# Altium schematic sheet 0165_VCCINAUX_CPU VR CO.SchDoc
size 848 x 558 mm
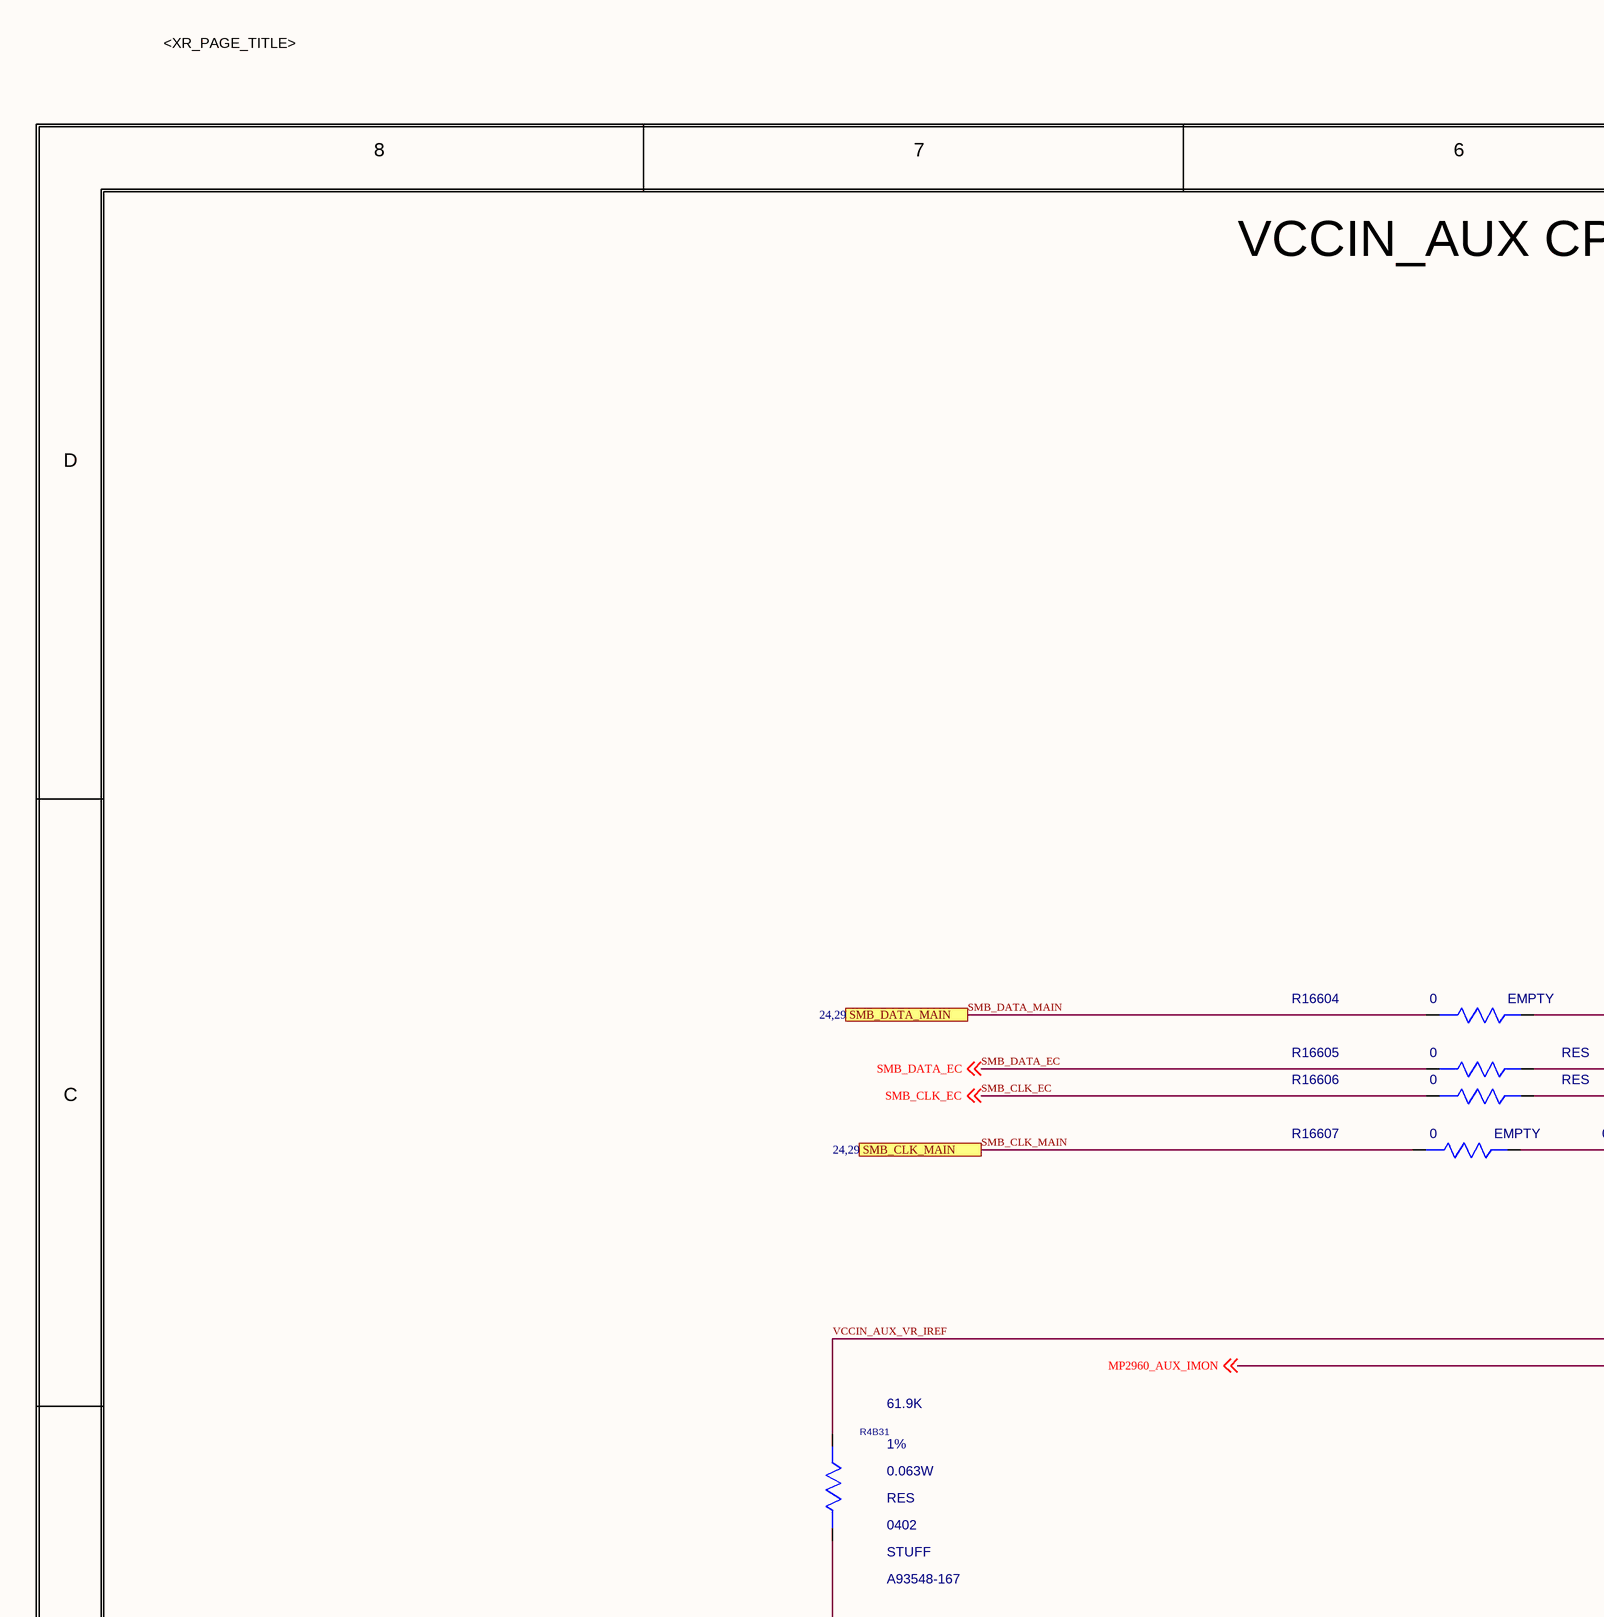
[diagram p0: 0165_VCCINAUX_CPU VR CO.SchDoc, top left]
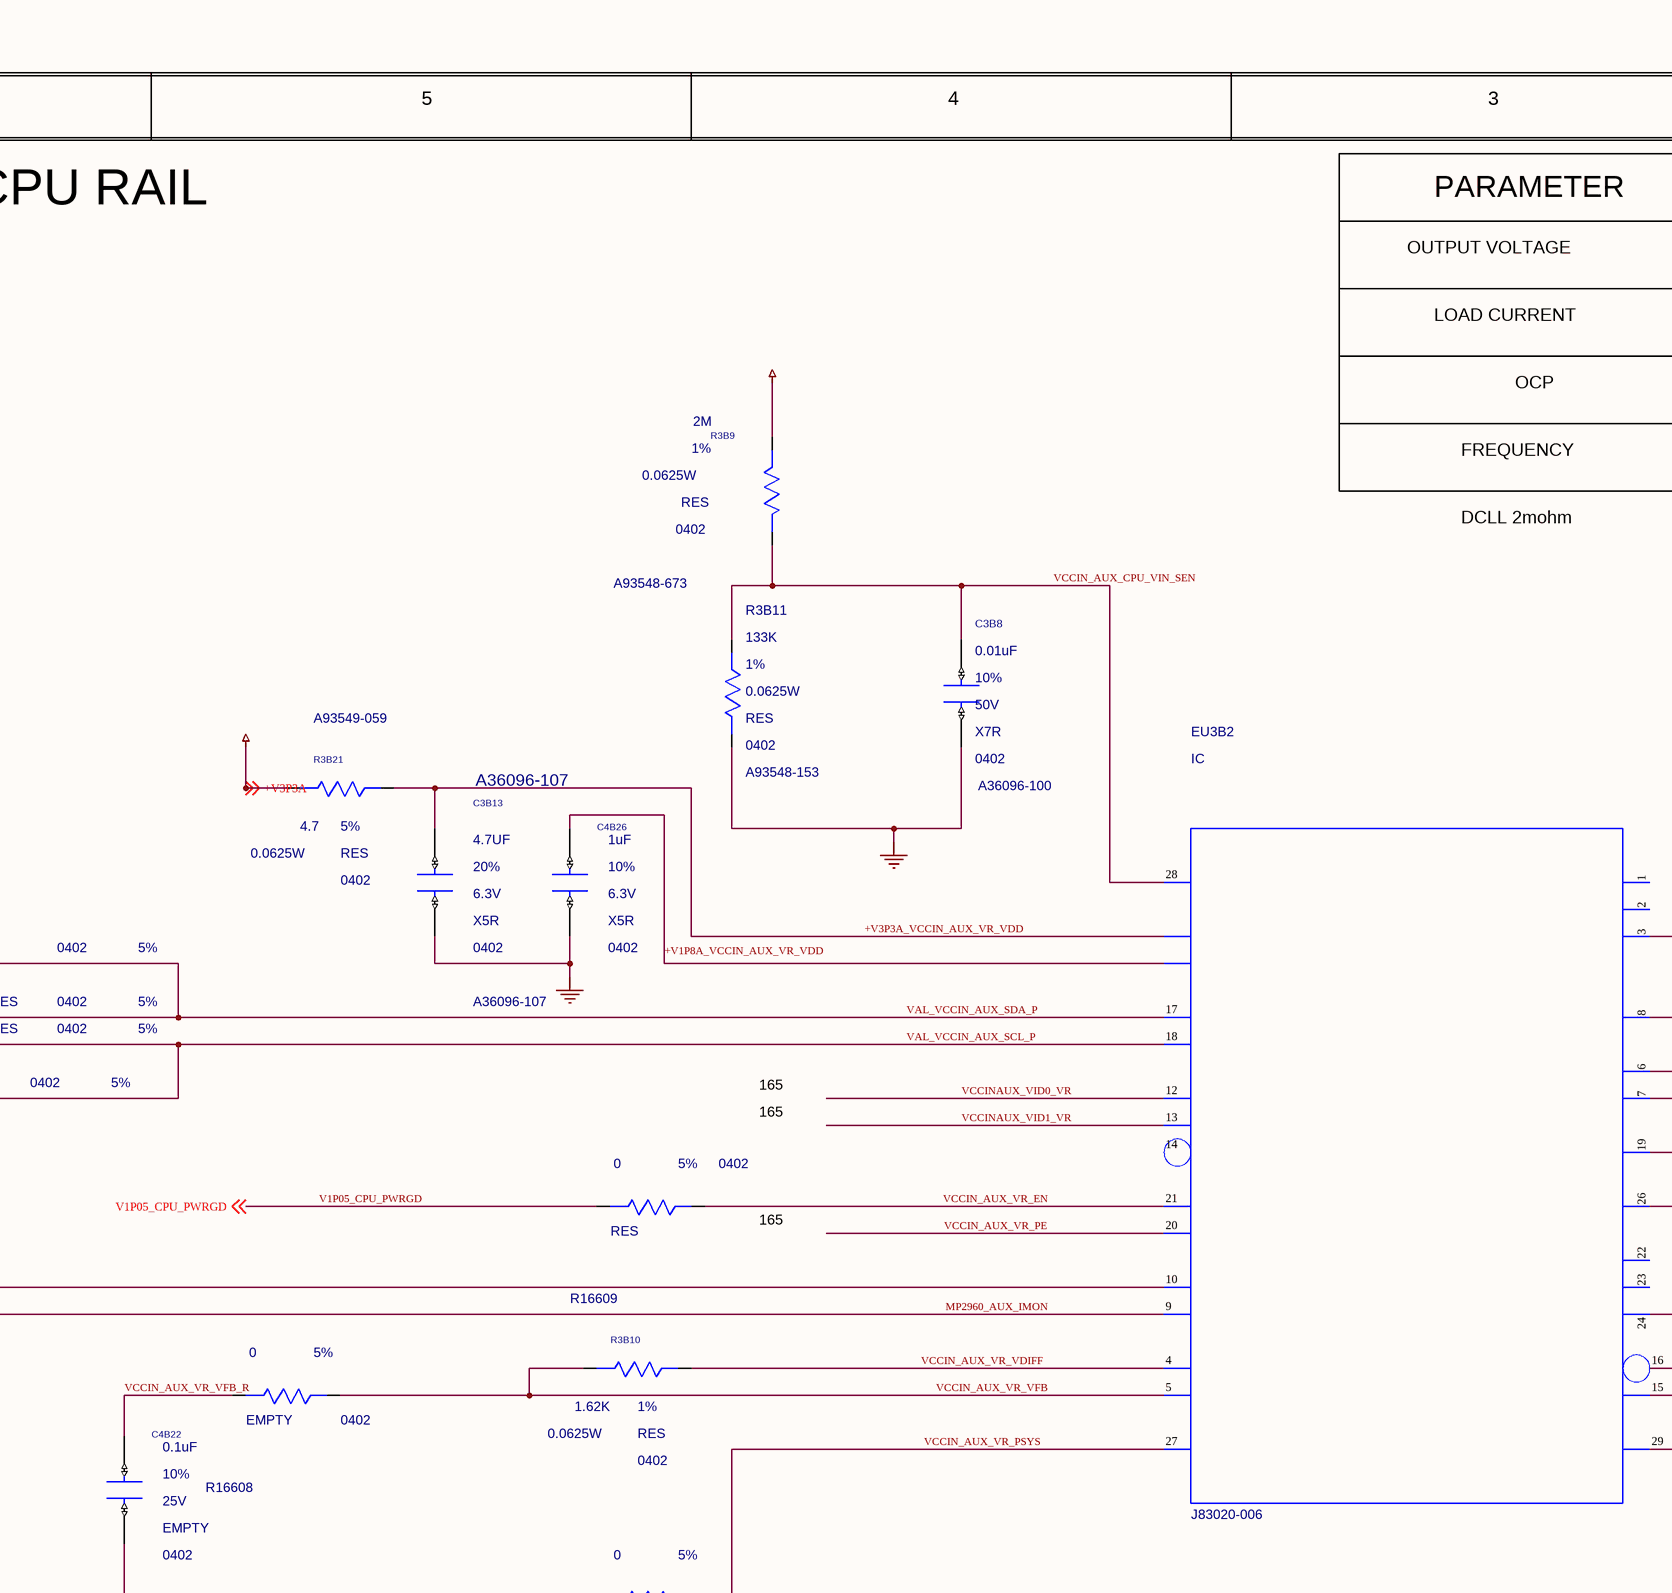
[diagram p1: 0165_VCCINAUX_CPU VR CO.SchDoc, top middle]
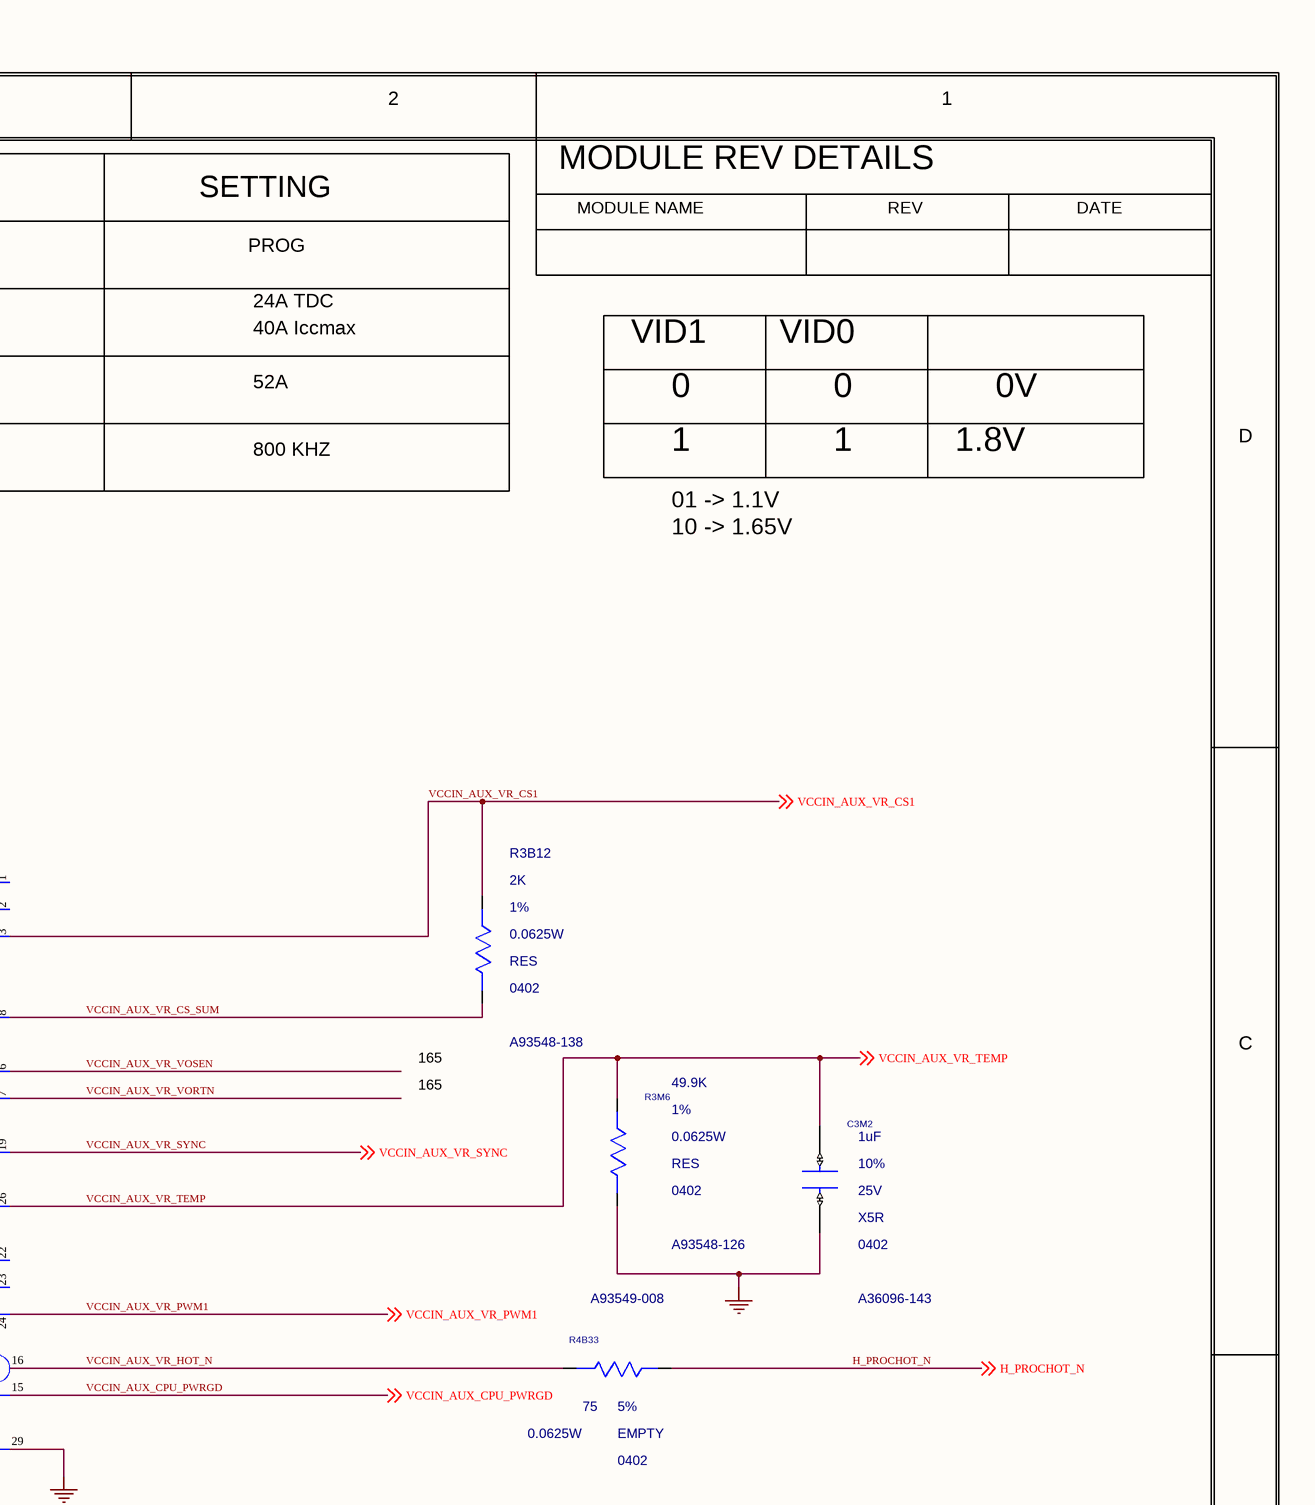
[diagram p2: 0165_VCCINAUX_CPU VR CO.SchDoc, top right]
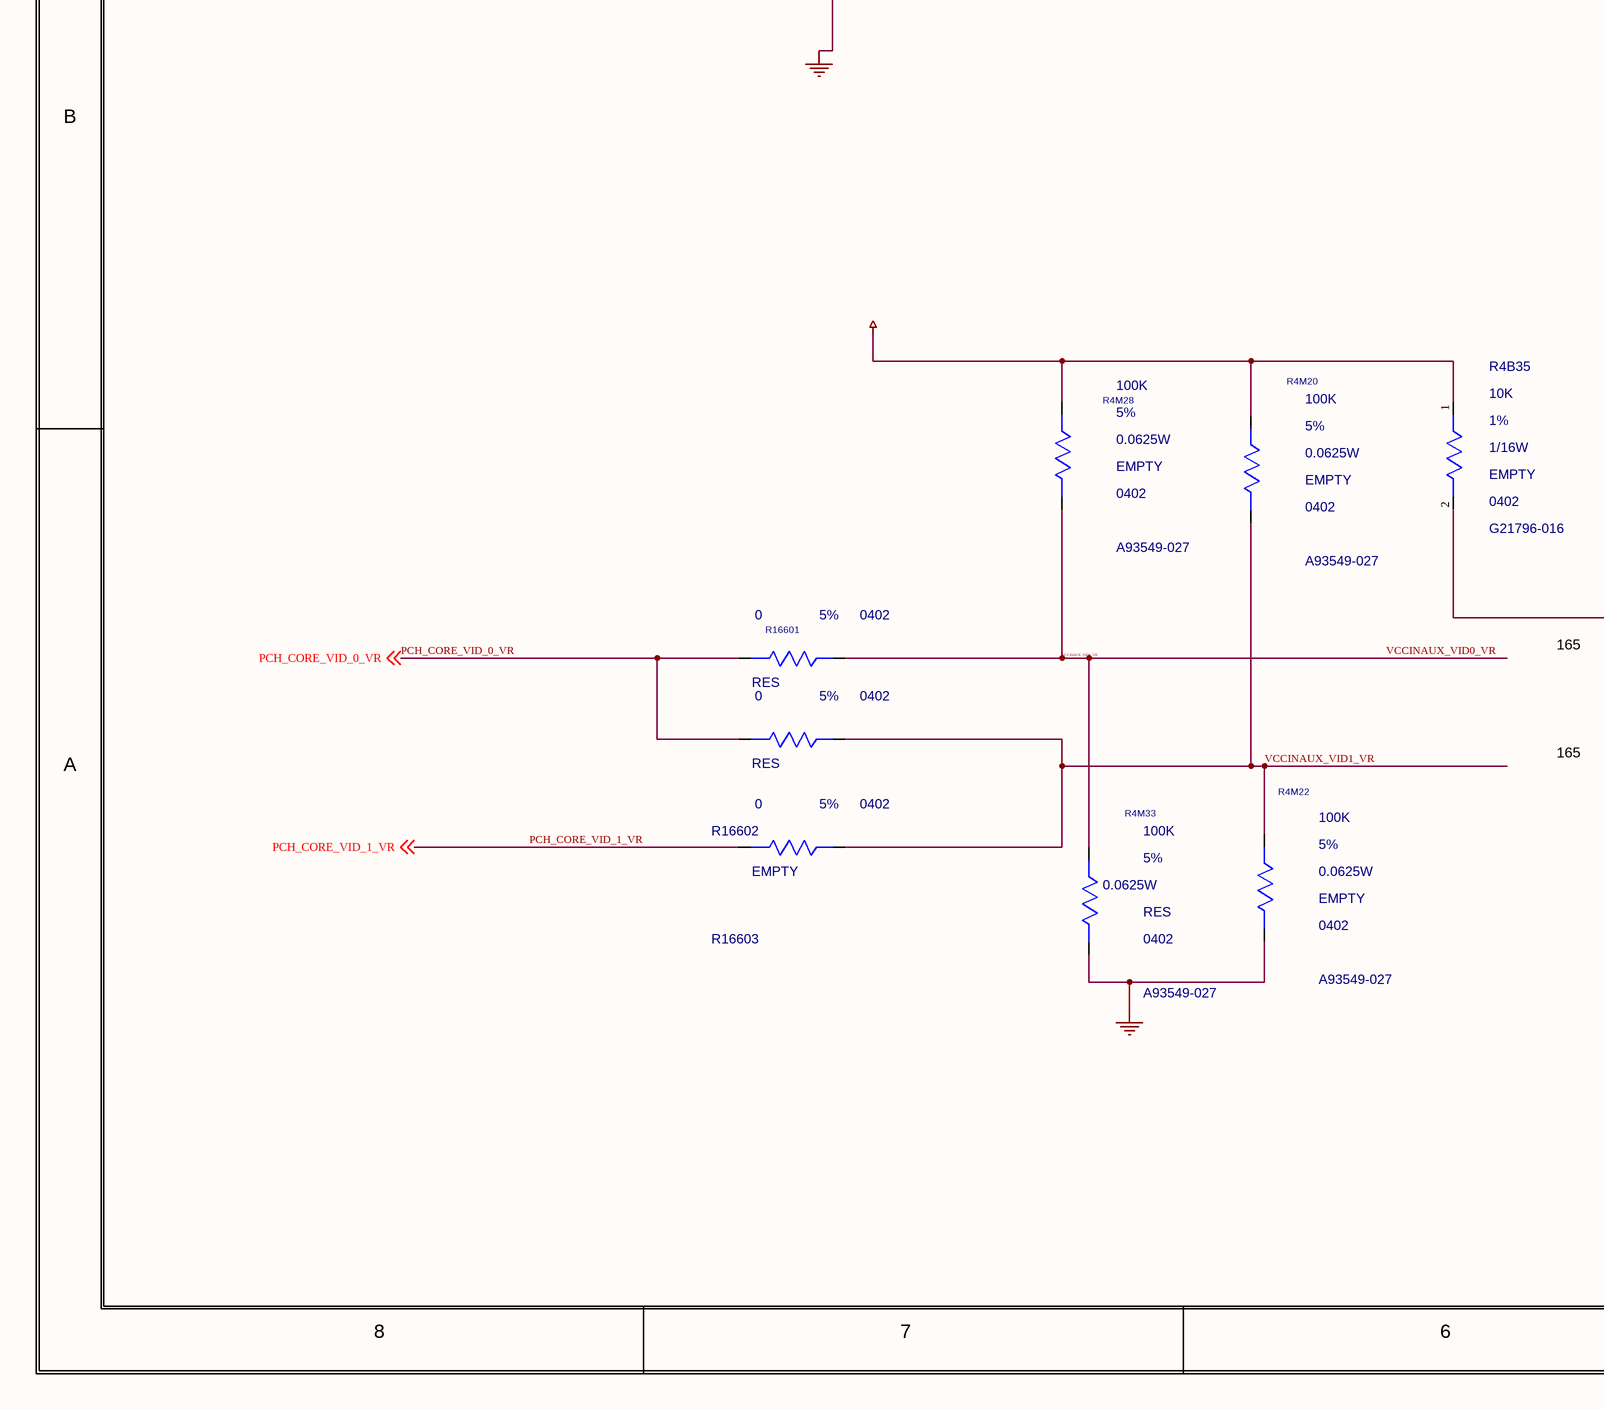
[diagram p3: 0165_VCCINAUX_CPU VR CO.SchDoc, bottom left]
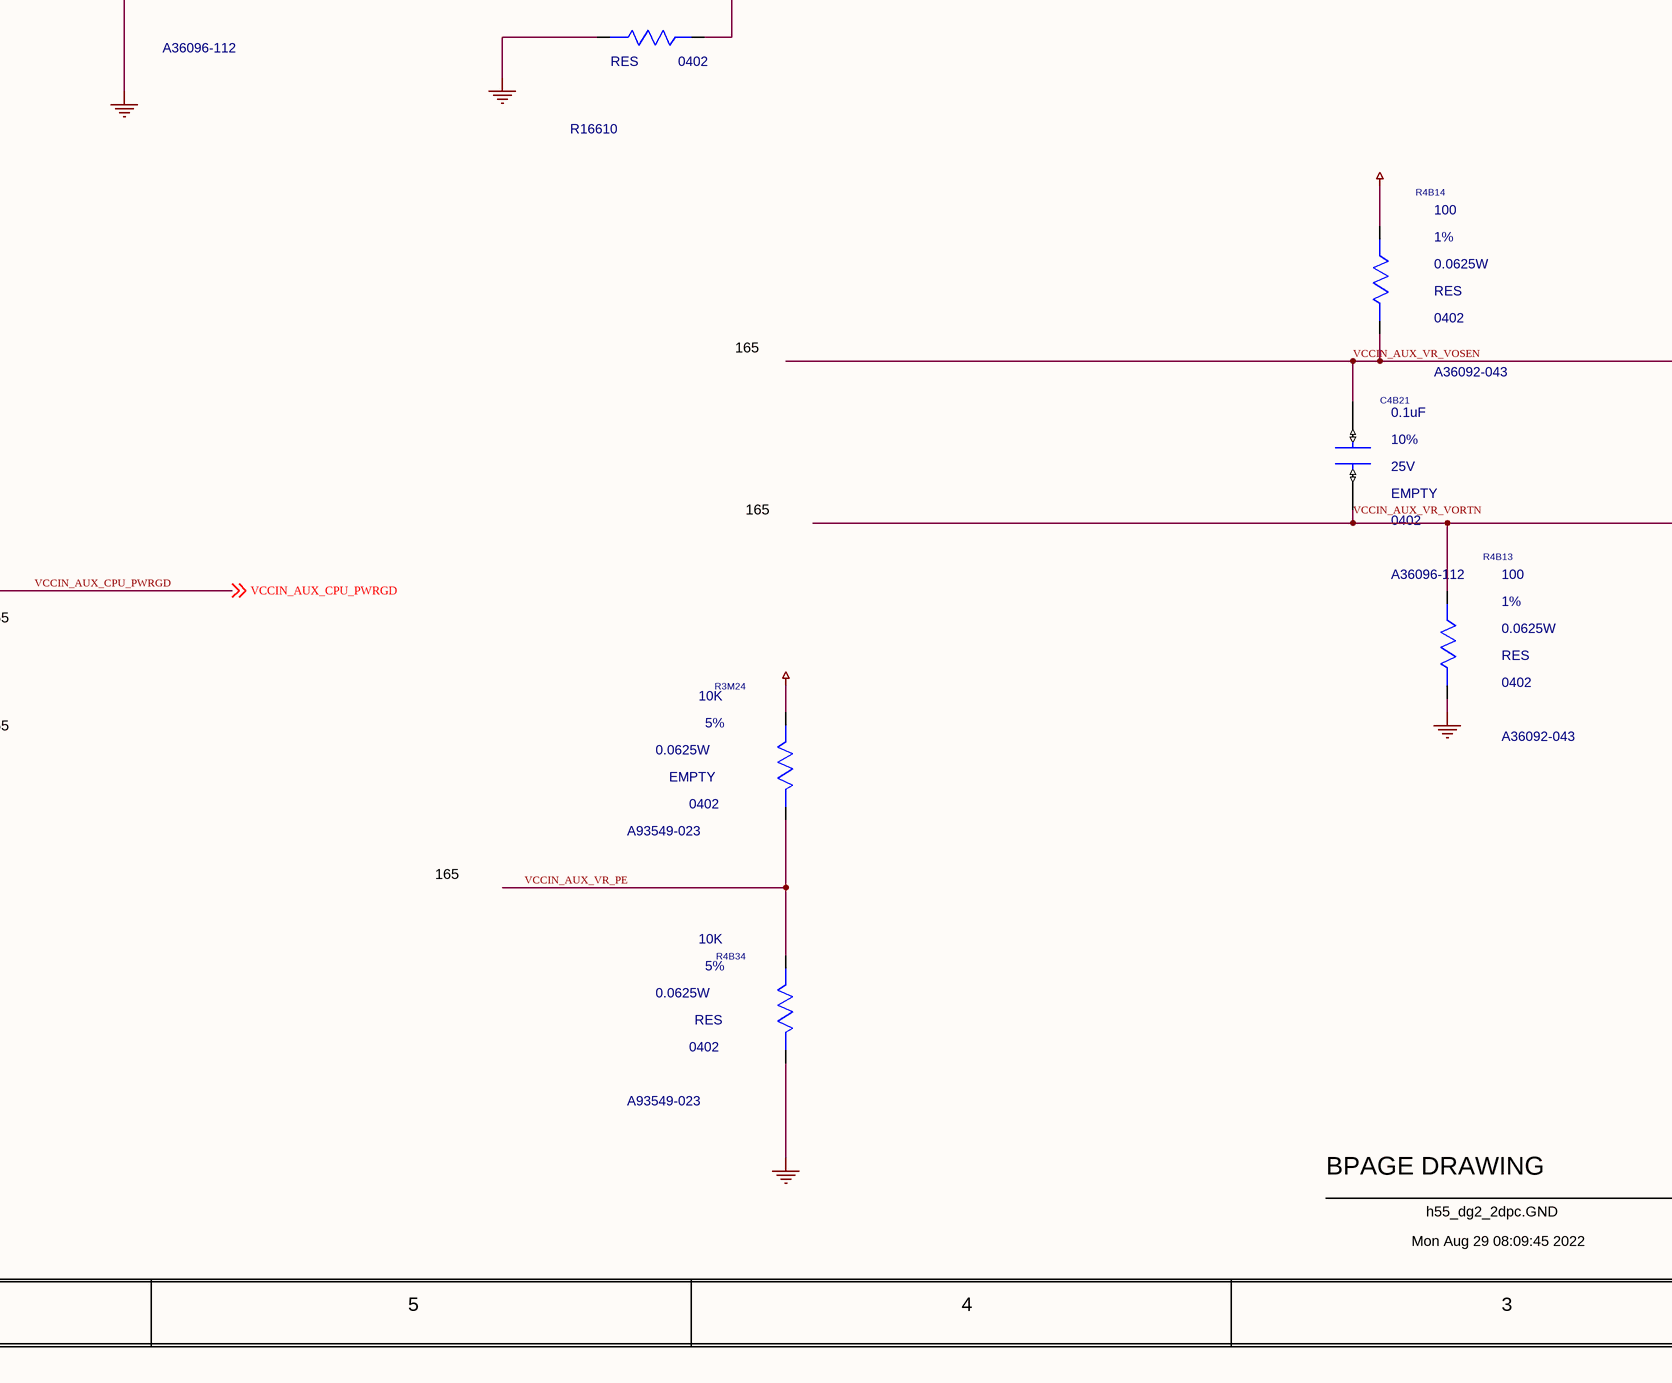
[diagram p4: 0165_VCCINAUX_CPU VR CO.SchDoc, bottom middle]
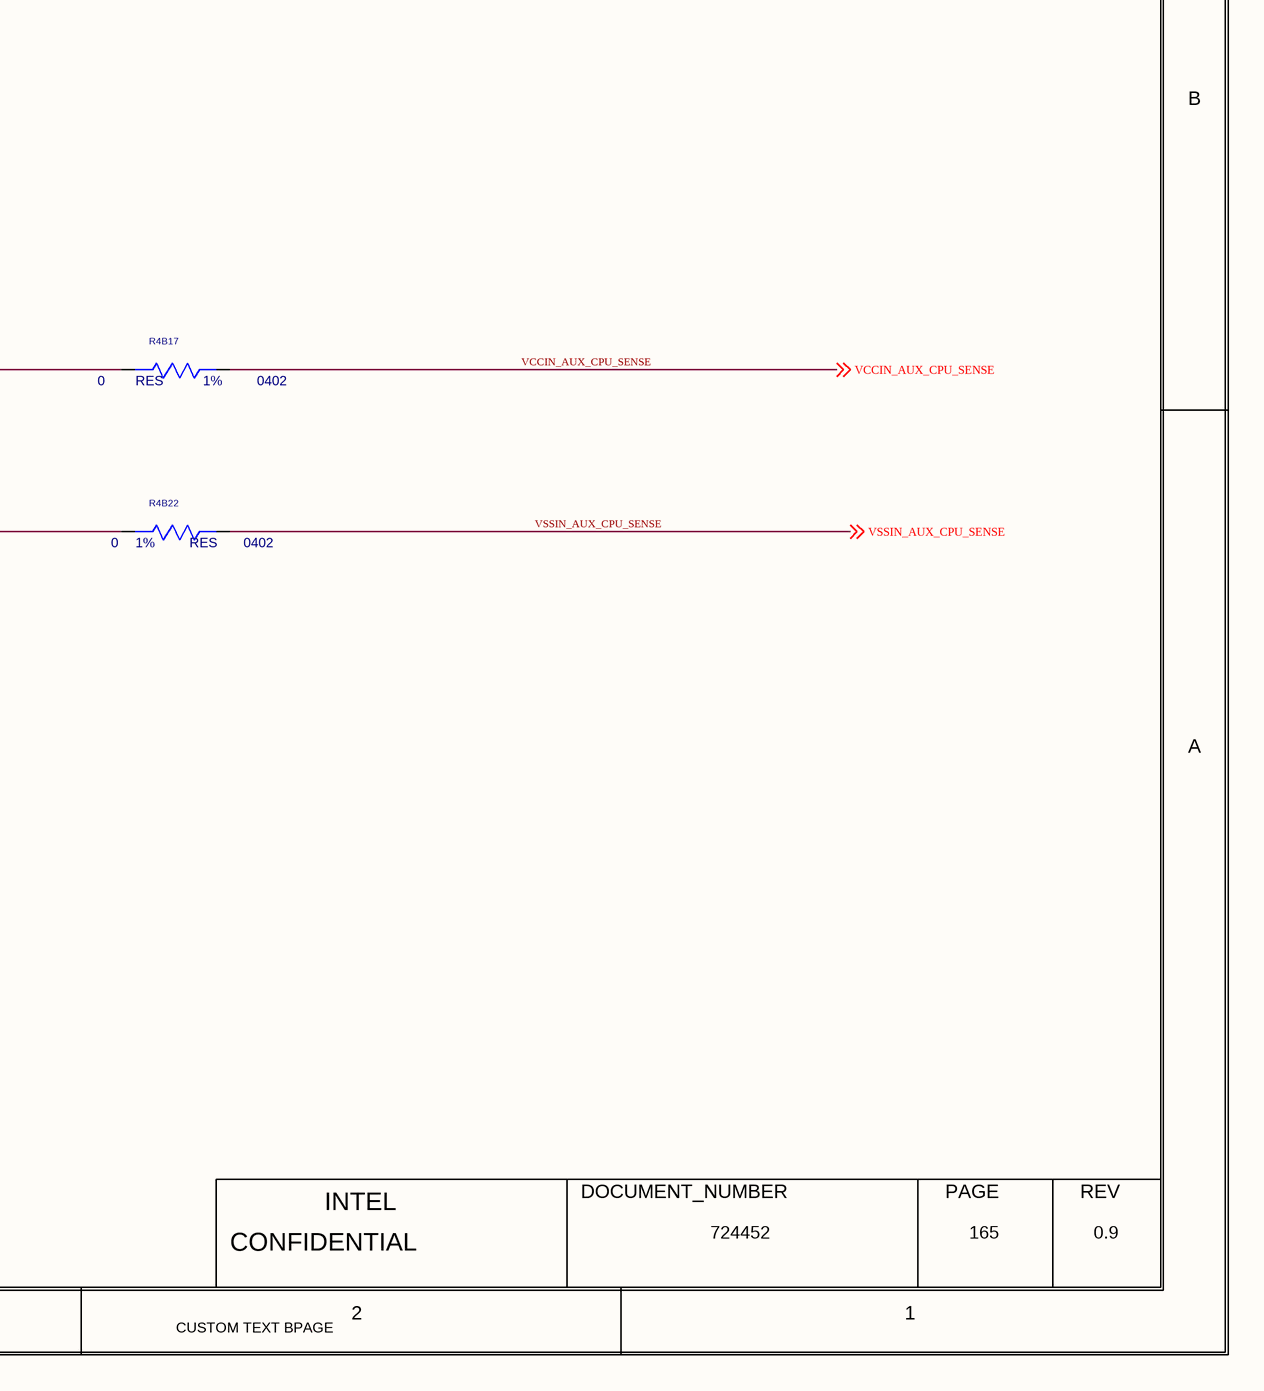
[diagram p5: 0165_VCCINAUX_CPU VR CO.SchDoc, bottom right]

## Parts
C3B8  0.01uF  MATERIAL: X7R  PACK_TYPE: 0402  PART_NUMBER: A36096-100  TOLERANCE: 10%  VOLTAGE: 50V  [CTK2_SM0402_1050X550_MA]
C3B13  4.7UF  MATERIAL: X5R  PACK_TYPE: 0402  PART_NUMBER: A36096-107  TOLERANCE: 20%  VOLTAGE: 6.3V  [CTK2_SM0402_1200X700_MA]
C3M2  1uF  MATERIAL: X5R  PACK_TYPE: 0402  PART_NUMBER: A36096-143  TOLERANCE: 10%  VOLTAGE: 25V  [CTK0_SM0402_1050X550_MA]
C4B21  0.1uF  MATERIAL: EMPTY  PACK_TYPE: 0402  PART_NUMBER: A36096-112  TOLERANCE: 10%  VOLTAGE: 25V  [CTK0_SM0402_1050X550_MA]
C4B22  0.1uF  MATERIAL: EMPTY  PACK_TYPE: 0402  PART_NUMBER: A36096-112  TOLERANCE: 10%  VOLTAGE: 25V  [CTK0_SM0402_1050X550_MA]
C4B26  1uF  MATERIAL: X5R  PACK_TYPE: 0402  TOLERANCE: 10%  VOLTAGE: 6.3V  [CTK2_SM0402_1050X550_MA]
EU3B2  MATERIAL: IC  PART_NUMBER: J83020-006  [CTK2_LCC28_S4100_400_DFS2600_MB]  (hidden comment: C_MP2940C)
R3B9  2M  MATERIAL: RES  PACK_TYPE: 0402  PART_NUMBER: A93548-673  TOLERANCE: 1%  WATTAGE: 0.0625W  [CTK0_SM0402_1050X550_MA]
R3B10  1.62K  MATERIAL: RES  PACK_TYPE: 0402  TOLERANCE: 1%  WATTAGE: 0.0625W  [CTK2_SM0402_1100X550_MA]
R3B11  133K  MATERIAL: RES  PACK_TYPE: 0402  PART_NUMBER: A93548-153  TOLERANCE: 1%  WATTAGE: 0.0625W  [CTK2_SM0402_1100X550_MA]
R3B12  2K  MATERIAL: RES  PACK_TYPE: 0402  PART_NUMBER: A93548-138  TOLERANCE: 1%  WATTAGE: 0.0625W  [CTK2_SM0402_1100X550_MA]
R3B21  4.7  MATERIAL: RES  PACK_TYPE: 0402  PART_NUMBER: A93549-059  TOLERANCE: 5%  WATTAGE: 0.0625W  [CTK0_SM0402_1100X550_MA]
R3M6  49.9K  MATERIAL: RES  PACK_TYPE: 0402  PART_NUMBER: A93548-126  TOLERANCE: 1%  WATTAGE: 0.0625W  [CTK0_SM0402_1100X550_MA]
R3M24  10K  MATERIAL: EMPTY  PACK_TYPE: 0402  PART_NUMBER: A93549-023  TOLERANCE: 5%  WATTAGE: 0.0625W  [CTK0_SM0402_1100X550_MA]
R4B13  100  MATERIAL: RES  PACK_TYPE: 0402  PART_NUMBER: A36092-043  TOLERANCE: 1%  WATTAGE: 0.0625W  [CTK0_SM0402_1050X550_MA]
R4B14  100  MATERIAL: RES  PACK_TYPE: 0402  PART_NUMBER: A36092-043  TOLERANCE: 1%  WATTAGE: 0.0625W  [CTK0_SM0402_1050X550_MA]
R4B17  0  MATERIAL: RES  PACK_TYPE: 0402  TOLERANCE: 1%  [CTK2_SM0402_1050X550_MA]
R4B22  0  MATERIAL: RES  PACK_TYPE: 0402  TOLERANCE: 1%  [CTK2_SM0402_1050X550_MA]
R4B31  61.9K  BOM_USE: STUFF  MATERIAL: RES  PACK_TYPE: 0402  PART_NUMBER: A93548-167  TOLERANCE: 1%  WATTAGE: 0.063W  [TK0_SM0402_1100X550_MI]
R4B33  75  MATERIAL: EMPTY  PACK_TYPE: 0402  PART_NUMBER: A93549-008  TOLERANCE: 5%  WATTAGE: 0.0625W  [CTK2_SM0402_1050X550_MA]
R4B34  10K  MATERIAL: RES  PACK_TYPE: 0402  PART_NUMBER: A93549-023  TOLERANCE: 5%  WATTAGE: 0.0625W  [CTK0_SM0402_1100X550_MA]
R4B35  10K  MATERIAL: EMPTY  PACK_TYPE: 0402  PART_NUMBER: G21796-016  TOLERANCE: 1%  WATTAGE: 1/16W  [SMR0402IA]
R4M20  100K  MATERIAL: EMPTY  PACK_TYPE: 0402  PART_NUMBER: A93549-027  TOLERANCE: 5%  WATTAGE: 0.0625W  [CTK0_SM0402_1100X550_MA]
R4M22  100K  MATERIAL: EMPTY  PACK_TYPE: 0402  PART_NUMBER: A93549-027  TOLERANCE: 5%  WATTAGE: 0.0625W  [CTK0_SM0402_1100X550_MA]
R4M28  100K  MATERIAL: EMPTY  PACK_TYPE: 0402  PART_NUMBER: A93549-027  TOLERANCE: 5%  WATTAGE: 0.0625W  [CTK0_SM0402_1100X550_MA]
R4M33  100K  MATERIAL: RES  PACK_TYPE: 0402  PART_NUMBER: A93549-027  TOLERANCE: 5%  WATTAGE: 0.0625W  [CTK0_SM0402_1100X550_MA]
R16601  0  MATERIAL: RES  PACK_TYPE: 0402  TOLERANCE: 5%  [CTK0_SM0402_1100X550_MA]
R16602  0  MATERIAL: RES  PACK_TYPE: 0402  TOLERANCE: 5%  [CTK0_SM0402_1100X550_MA]
R16603  0  MATERIAL: EMPTY  PACK_TYPE: 0402  TOLERANCE: 5%  [CTK0_SM0402_1100X550_MA]
R16604  0  MATERIAL: EMPTY  PACK_TYPE: 0402  TOLERANCE: 5%  [CTK0_SM0402_1100X550_MA]
R16605  0  MATERIAL: RES  PACK_TYPE: 0402  TOLERANCE: 5%  [CTK0_SM0402_1100X550_MA]
R16606  0  MATERIAL: RES  PACK_TYPE: 0402  TOLERANCE: 5%  [CTK0_SM0402_1100X550_MA]
R16607  0  MATERIAL: EMPTY  PACK_TYPE: 0402  TOLERANCE: 5%  [CTK0_SM0402_1100X550_MA]
R16608  0  MATERIAL: EMPTY  PACK_TYPE: 0402  TOLERANCE: 5%  [CTK0_SM0402_1100X550_MA]
R16609  0  MATERIAL: RES  PACK_TYPE: 0402  TOLERANCE: 5%  [CTK0_SM0402_1100X550_MA]
R16610  0  MATERIAL: RES  PACK_TYPE: 0402  TOLERANCE: 5%  [CTK0_SM0402_1100X550_MA]

## Ports
SMB_CLK_MAIN, SMB_DATA_MAIN

## Nets
+V3P3A: R3B21.1(A) R3M24.1(A) R4B35.1(A) R4M20.1(A) R4M28.1(A) ; off-sheet +V3P3A
+VBATA_VCCIN_AUX_VIN: R3B9.1(A)
+VCCIN_AUX_PROC: R4B14.1(A)
GND: C3B8.2(B) C3B13.2(B) C3M2.2(B) C4B22.2(B) C4B26.2(B) EU3B2.29(AGND_TPD) R3B11.2(B) R3M6.2(B) R4B13.2(B) R4B31.2(B) R4B34.2(B) R4M22.2(B) R4M33.2(B) R16610.1(A)
VDD18: EU3B2.11(VDD18)
VDD33: EU3B2.25(VDD33)
+V1P8A_VCCIN_AUX_VR_VDD: C4B26.1(A)
+V3P3A_VCCIN_AUX_VR_VDD: C3B13.1(A) R3B21.2(B)
H_PROCHOT_N: R4B33.2(B) ; off-sheet H_PROCHOT_N
MP2960_AUX_IMON: EU3B2.9(IMON) ; off-sheet MP2960_AUX_IMON
PCH_CORE_VID_0_VR: R16601.1(A) R16602.1(A) ; off-sheet PCH_CORE_VID_0_VR
PCH_CORE_VID_1_VR: R16603.1(A) ; off-sheet PCH_CORE_VID_1_VR
SMB_CLK_EC: R16606.1(A) ; off-sheet SMB_CLK_EC
SMB_CLK_MAIN: R16607.1(A) ; port SMB_CLK_MAIN
SMB_DATA_EC: R16605.1(A) ; off-sheet SMB_DATA_EC
SMB_DATA_MAIN: R16604.1(A) ; port SMB_DATA_MAIN
V1P05_CPU_PWRGD: R16609.1(A) ; off-sheet V1P05_CPU_PWRGD
VAL_VCCIN_AUX_SCL_P: EU3B2.18(SCL_P) R16606.2(B) R16607.2(B)
VAL_VCCIN_AUX_SDA_P: EU3B2.17(SDA_P) R16604.2(B) R16605.2(B)
VCCIN_AUX_CPU_PWRGD: EU3B2.15(VRRDY) R4B35.2(B) ; off-sheet VCCIN_AUX_CPU_PWRGD
VCCIN_AUX_CPU_SENSE: R4B17.2(B) ; off-sheet VCCIN_AUX_CPU_SENSE
VCCIN_AUX_CPU_VIN_SEN: C3B8.1(A) EU3B2.28(VIN_SEN) R3B9.2(B) R3B11.1(A)
VCCIN_AUX_VR_CS1: EU3B2.3(CS1) R3B12.1(A) ; off-sheet VCCIN_AUX_VR_CS1
VCCIN_AUX_VR_CS_SUM: EU3B2.8(CSSUM) R3B12.2(B)
VCCIN_AUX_VR_EN: EU3B2.21(EN) R16609.2(B)
VCCIN_AUX_VR_HOT_N: EU3B2.16(VRHOT_N) R4B33.1(A)
VCCIN_AUX_VR_IREF: EU3B2.10(IREF) R4B31.1(A)
VCCIN_AUX_VR_PE: EU3B2.20(PE) R3M24.2(B) R4B34.1(A)
VCCIN_AUX_VR_PSYS: EU3B2.27(PSYS) R16610.2(B)
VCCIN_AUX_VR_PWM1: EU3B2.24(PWM1) ; off-sheet VCCIN_AUX_VR_PWM1
VCCIN_AUX_VR_SYNC: EU3B2.19(STB) ; off-sheet VCCIN_AUX_VR_SYNC
VCCIN_AUX_VR_TEMP: C3M2.1(A) EU3B2.26(TEMP) R3M6.1(A) ; off-sheet VCCIN_AUX_VR_TEMP
VCCIN_AUX_VR_VDIFF: EU3B2.4(VDIFF) R3B10.2(B)
VCCIN_AUX_VR_VFB: EU3B2.5(VFB) R3B10.1(A) R16608.2(B)
VCCIN_AUX_VR_VFB_R: C4B22.1(A) R16608.1(A)
VCCIN_AUX_VR_VORTN: C4B21.2(B) EU3B2.7(VORTN) R4B13.1(A) R4B22.1(A)
VCCIN_AUX_VR_VOSEN: C4B21.1(A) EU3B2.6(VOSEN) R4B14.2(B) R4B17.1(A)
VCCINAUX_VID0_VR: EU3B2.12(SCLK_VID0) R4M28.2(B) R4M33.1(A) R16601.2(B)
VCCINAUX_VID1_VR: EU3B2.13(SDIO_VID1) R4M20.2(B) R4M22.1(A) R16602.2(B) R16603.2(B)
VSSIN_AUX_CPU_SENSE: R4B22.2(B) ; off-sheet VSSIN_AUX_CPU_SENSE

Not connected (* = marked no-connect by the designer): EU3B2 1(CS3) 2(CS2) 14(ALT_N) 22(PWM3) 23(PWM2)

## Notes on the sheet
- <XR_PAGE_TITLE>
- 8
- 7
- 6
- 5
- 4
- 3
- 2
- 1
- PARAMETER
- SETTING
- MODULE REV DETAILS
- VCCIN_AUX CPU RAIL
- OUTPUT VOLTAGE
- PROG
- MODULE NAME
- REV
- DATE
- LOAD CURRENT
- 24A TDC
- 40A Iccmax
- OCP
- 52A
- VID1
- 0
- VID0
- 0V
- D
- FREQUENCY
- 800 KHZ
- 1.8V
- DCLL 2mohm
- 10 -> 1.65V
- 01 -> 1.1V
- C
- 165
- B
- A
- BPAGE DRAWING
- INTEL
- DOCUMENT_NUMBER
- PAGE
- Mon Aug 29 08:09:45 2022
- h55_dg2_2dpc.GND
- CONFIDENTIAL
- 724452
- 0.9
- CUSTOM TEXT BPAGE

## Library data of the parts
C3B8 = C_CAP: CDS_PHYS_PART_NAME: C_CAP_0402-A36096-100,X7R,0.01UF,50V,10%,TK2,GENERIC; CDS_LMAN_SYM_OUTLINE: -50,50,50,-50; FP_TECH: TK2; IP: GENERIC; ROOM: NONE; OriginalSymbolOrigin: (-50,25); XY: (3875,-3325); VER: 1; ROT: 0; PHYS_PAGE: 165; LOCATION: C3B8; DRAWING: @RVP1_ADL_SB_ADP_S_DDR5_SODIMM_2DPC_LIB.H55_DG2_2DPC(SCH_1):PAGE534; CDS_LIB: c_discrete; VARIANT: ?; PCB Footprint: CTK2_SM0402_1050X550_MA; CHIPS_PART_NAME: C_CAP; CDS_PART_NAME: C_CAP_0402-A36096-100,X7R,0.01UF,50V,10%,TK2,GENERIC; CDS_LOCATION: C3B8
C3B13 = C_CAP: CDS_PHYS_PART_NAME: C_CAP_0402-A36096-107,X5R,4.7UF,6.3V,20%,TK2,GENERIC; CDS_LMAN_SYM_OUTLINE: -50,50,50,-50; FP_TECH: TK2; IP: GENERIC; ROOM: NONE; OriginalSymbolOrigin: (-50,25); XY: (2900,-3675); VER: 1; ROT: 0; PHYS_PAGE: 165; LOCATION: C3B13; DRAWING: @RVP1_ADL_SB_ADP_S_DDR5_SODIMM_2DPC_LIB.H55_DG2_2DPC(SCH_1):PAGE534; CDS_LIB: c_discrete; VARIANT: ?; PCB Footprint: CTK2_SM0402_1200X700_MA; CHIPS_PART_NAME: C_CAP; CDS_PART_NAME: C_CAP_0402-A36096-107,X5R,4.7UF,6.3V,20%,TK2,GENERIC; CDS_LOCATION: C3B13; ASI_MODEL: A36096-107
C3M2 = C_CAP: CDS_PHYS_PART_NAME: C_CAP_0402-A36096-143,X5R,1UF,25V,10%,TK0,GENERIC; CDS_LMAN_SYM_OUTLINE: -50,50,50,-50; FP_TECH: TK0; IP: GENERIC; ROOM: NONE; OriginalSymbolOrigin: (-50,25); XY: (6650,-4225); VER: 1; ROT: 0; PHYS_PAGE: 165; LOCATION: C3M2; DRAWING: @RVP1_ADL_SB_ADP_S_DDR5_SODIMM_2DPC_LIB.H55_DG2_2DPC(SCH_1):PAGE534; CDS_LIB: c_discrete; VARIANT: ?; PCB Footprint: CTK0_SM0402_1050X550_MA; CHIPS_PART_NAME: C_CAP; CDS_PART_NAME: C_CAP_0402-A36096-143,X5R,1UF,25V,10%,TK0,GENERIC; CDS_LOCATION: C3M2; ASI_MODEL: A36096-143
C4B21 = C_CAP: CDS_PHYS_PART_NAME: C_CAP_0402-A36096-112,EMPTY,0.1UF,25V,10%,TK0,GENERIC; CDS_LMAN_SYM_OUTLINE: -50,50,50,-50; FP_TECH: TK0; IP: GENERIC; ROOM: NONE; OriginalSymbolOrigin: (-50,25); XY: (4600,-5775); VER: 1; ROT: 0; PHYS_PAGE: 165; LOCATION: C4B21; DRAWING: @RVP1_ADL_SB_ADP_S_DDR5_SODIMM_2DPC_LIB.H55_DG2_2DPC(SCH_1):PAGE534; CDS_LIB: c_discrete; VARIANT: ?; PCB Footprint: CTK0_SM0402_1050X550_MA; CHIPS_PART_NAME: C_CAP; CDS_PART_NAME: C_CAP_0402-A36096-112,EMPTY,0.1UF,25V,10%,TK0,GENERIC; CDS_LOCATION: C4B21; ASI_MODEL: A36096-112
C4B22 = C_CAP: CDS_PHYS_PART_NAME: C_CAP_0402-A36096-112,EMPTY,0.1UF,25V,10%,TK0,GENERIC; CDS_LMAN_SYM_OUTLINE: -50,50,50,-50; FP_TECH: TK0; IP: GENERIC; ROOM: NONE; OriginalSymbolOrigin: (-50,25); XY: (2325,-4800); VER: 1; ROT: 0; PHYS_PAGE: 165; LOCATION: C4B22; DRAWING: @RVP1_ADL_SB_ADP_S_DDR5_SODIMM_2DPC_LIB.H55_DG2_2DPC(SCH_1):PAGE534; CDS_LIB: c_discrete; VARIANT: ?; PCB Footprint: CTK0_SM0402_1050X550_MA; CHIPS_PART_NAME: C_CAP; CDS_PART_NAME: C_CAP_0402-A36096-112,EMPTY,0.1UF,25V,10%,TK0,GENERIC; CDS_LOCATION: C4B22; ASI_MODEL: A36096-112
C4B26 = C_CAP: PART_NUMBER: A36096-027; CDS_PHYS_PART_NAME: CAP_402-1UF,10%,16V"; CDS_PART_NAME: C_CAP_0402-A36096-027,X5R,1UF,6.3V,10%,TK2,GENERIC; CDS_LMAN_SYM_OUTLINE: -50,50,50,-50; FP_TECH: TK2; IP: GENERIC; ROOM: NONE; OriginalSymbolOrigin: (-50,25); XY: (3150,-3675); VER: 1; ROT: 0; PHYS_PAGE: 165; LOCATION: C4B26; DRAWING: @RVP1_ADL_SB_ADP_S_DDR5_SODIMM_2DPC_LIB.H55_DG2_2DPC(SCH_1):PAGE534; CDS_LIB: c_discrete; VARIANT: ?; PCB Footprint: CTK2_SM0402_1050X550_MA; CHIPS_PART_NAME: C_CAP; CDS_LOCATION: C4B26; ASI_MODEL: A36096-027
EU3B2 = C_MP2940C: CDS_PHYS_PART_NAME: C_MP2940C_LCC-J83020-006,IC,MP2940CGRT-0017,TK2,GENERIC; CDS_LMAN_SYM_OUTLINE: -400,650,400,-600; FP_TECH: TK2; IP: GENERIC; PACK_TYPE: LCC; ROOM: NONE; OriginalSymbolOrigin: (-450,650); XY: (4700,-4225); VER: 1; ROT: 0; PHYS_PAGE: 165; LOCATION: EU3B2; DRAWING: @RVP1_ADL_SB_ADP_S_DDR5_SODIMM_2DPC_LIB.H55_DG2_2DPC(SCH_1):PAGE534; CDS_LIB: local; ASI_MODEL: M41157-001; VARIANT: ?; PCB Footprint: CTK2_LCC28_S4100_400_DFS2600_MB; SEC_TYPE: LCC; CHIPS_PART_NAME: C_MP2940C; CDS_PART_NAME: C_MP2940C_LCC-J83020-006,IC,MP2940CGRT-0017,TK2,GENERIC; CDS_LOCATION: EU3B2
R3B9 = C_RES: CDS_PHYS_PART_NAME: C_RES_0402-A93548-673,RES,2M,1%,0.0625W,TK0,GENERIC; CDS_LMAN_SYM_OUTLINE: -50,50,50,-50; FP_TECH: TK0; IP: GENERIC; ROOM: NONE; OriginalSymbolOrigin: (-25,75); XY: (3525,-2950); VER: 2; PHYS_PAGE: 165; LOCATION: R3B9; DRAWING: @RVP1_ADL_SB_ADP_S_DDR5_SODIMM_2DPC_LIB.H55_DG2_2DPC(SCH_1):PAGE534; CDS_LIB: c_discrete; VARIANT: ?; PCB Footprint: CTK0_SM0402_1050X550_MA; ROT: 2; CHIPS_PART_NAME: C_RES; CDS_PART_NAME: C_RES_0402-A93548-673,RES,2M,1%,0.0625W,TK0,GENERIC; CDS_LOCATION: R3B9; ASI_MODEL: A93548-673
R3B10 = C_RES#1: PART_NUMBER: A93548-116; CHIPS_PART_NAME: C_RES; CDS_PHYS_PART_NAME: C_RES_0402-A93548-116,RES,1.62K,1%,0.0625W,TK2,GENERIC; CDS_LMAN_SYM_OUTLINE: -50,50,50,-50; FP_TECH: TK2; IP: GENERIC; ROOM: NONE; OriginalSymbolOrigin: (-75,25); XY: (3275,-4575); VER: 1; ROT: 0; PHYS_PAGE: 165; LOCATION: R3B10; DRAWING: @RVP1_ADL_SB_ADP_S_DDR5_SODIMM_2DPC_LIB.H55_DG2_2DPC(SCH_1):PAGE534; CDS_LIB: c_discrete; VARIANT: ?; PCB Footprint: CTK2_SM0402_1100X550_MA; CDS_PART_NAME: C_RES_0402-A93548-116,RES,1.62K,1%,0.0625W,TK2,GENERIC; CDS_LOCATION: R3B10; ASI_MODEL: A93548-116
R3B11 = C_RES: CDS_PHYS_PART_NAME: C_RES_0402-A93548-153,RES,133K,1%,0.0625W,TK2,GENERIC; CDS_LMAN_SYM_OUTLINE: -50,50,50,-50; FP_TECH: TK2; IP: GENERIC; ROOM: NONE; OriginalSymbolOrigin: (-25,75); XY: (3450,-3325); VER: 2; ROT: 0; PHYS_PAGE: 165; LOCATION: R3B11; DRAWING: @RVP1_ADL_SB_ADP_S_DDR5_SODIMM_2DPC_LIB.H55_DG2_2DPC(SCH_1):PAGE534; CDS_LIB: c_discrete; VARIANT: ?; PCB Footprint: CTK2_SM0402_1100X550_MA; CHIPS_PART_NAME: C_RES; CDS_PART_NAME: C_RES_0402-A93548-153,RES,133K,1%,0.0625W,TK2,GENERIC; CDS_LOCATION: R3B11
R3B12 = C_RES: CDS_PHYS_PART_NAME: C_RES_0402-A93548-138,RES,2K,1%,0.0625W,TK2,GENERIC; CDS_LMAN_SYM_OUTLINE: -50,50,50,-50; FP_TECH: TK2; IP: GENERIC; ROOM: NONE; OriginalSymbolOrigin: (-25,75); XY: (6025,-3800); VER: 2; ROT: 0; PHYS_PAGE: 165; LOCATION: R3B12; DRAWING: @RVP1_ADL_SB_ADP_S_DDR5_SODIMM_2DPC_LIB.H55_DG2_2DPC(SCH_1):PAGE534; CDS_LIB: c_discrete; VARIANT: ?; PCB Footprint: CTK2_SM0402_1100X550_MA; CHIPS_PART_NAME: C_RES; CDS_PART_NAME: C_RES_0402-A93548-138,RES,2K,1%,0.0625W,TK2,GENERIC; CDS_LOCATION: R3B12
R3B21 = C_RES#1: CHIPS_PART_NAME: C_RES; CDS_PHYS_PART_NAME: C_RES_0402-A93549-059,RES,4.7,5%,0.0625W,TK0,GENERIC; CDS_LMAN_SYM_OUTLINE: -50,50,50,-50; FP_TECH: TK0; IP: GENERIC; ROOM: NONE; OriginalSymbolOrigin: (-75,25); XY: (2725,-3500); VER: 1; ROT: 0; PHYS_PAGE: 165; LOCATION: R3B21; DRAWING: @RVP1_ADL_SB_ADP_S_DDR5_SODIMM_2DPC_LIB.H55_DG2_2DPC(SCH_1):PAGE534; CDS_LIB: c_discrete; VARIANT: ?; PCB Footprint: CTK0_SM0402_1100X550_MA; CDS_PART_NAME: C_RES_0402-A93549-059,RES,4.7,5%,0.0625W,TK0,GENERIC; CDS_LOCATION: R3B21; ASI_MODEL: A93549-059
R3M6 = C_RES: CDS_PHYS_PART_NAME: C_RES_0402-A93548-126,RES,49.9K,1%,0.0625W,TK0,GENERIC; CDS_LMAN_SYM_OUTLINE: -50,50,50,-50; FP_TECH: TK0; IP: GENERIC; ROOM: NONE; OriginalSymbolOrigin: (-25,75); XY: (6275,-4175); VER: 2; ROT: 0; PHYS_PAGE: 165; LOCATION: R3M6; DRAWING: @RVP1_ADL_SB_ADP_S_DDR5_SODIMM_2DPC_LIB.H55_DG2_2DPC(SCH_1):PAGE534; CDS_LIB: c_discrete; VARIANT: ?; PCB Footprint: CTK0_SM0402_1100X550_MA; CHIPS_PART_NAME: C_RES; CDS_PART_NAME: C_RES_0402-A93548-126,RES,49.9K,1%,0.0625W,TK0,GENERIC; CDS_LOCATION: R3M6; ASI_MODEL: A93548-126
R3M24 = C_RES: CDS_PHYS_PART_NAME: C_RES_0402-A93549-023,EMPTY,10K,5%,0.0625W,TK0,GENERIC; CDS_LMAN_SYM_OUTLINE: -50,50,50,-50; FP_TECH: TK0; IP: GENERIC; ROOM: NONE; OriginalSymbolOrigin: (-25,75); XY: (3550,-6350); VER: 2; PHYS_PAGE: 165; LOCATION: R3M24; DRAWING: @RVP1_ADL_SB_ADP_S_DDR5_SODIMM_2DPC_LIB.H55_DG2_2DPC(SCH_1):PAGE534; CDS_LIB: c_discrete; VARIANT: ?; PCB Footprint: CTK0_SM0402_1100X550_MA; ROT: 2; CHIPS_PART_NAME: C_RES; CDS_PART_NAME: C_RES_0402-A93549-023,EMPTY,10K,5%,0.0625W,TK0,GENERIC; CDS_LOCATION: R3M24; ASI_MODEL: A93549-023
R4B13 = C_RES: CDS_PHYS_PART_NAME: C_RES_0402-A36092-043,RES,100,1%,0.0625W,TK0,GENERIC; CDS_LMAN_SYM_OUTLINE: -50,50,50,-50; FP_TECH: TK0; IP: GENERIC; ROOM: NONE; OriginalSymbolOrigin: (-25,75); XY: (4775,-6125); VER: 2; ROT: 0; PHYS_PAGE: 165; LOCATION: R4B13; DRAWING: @RVP1_ADL_SB_ADP_S_DDR5_SODIMM_2DPC_LIB.H55_DG2_2DPC(SCH_1):PAGE534; CDS_LIB: c_discrete; VARIANT: ?; PCB Footprint: CTK0_SM0402_1050X550_MA; CHIPS_PART_NAME: C_RES; CDS_PART_NAME: C_RES_0402-A36092-043,RES,100,1%,0.0625W,TK0,GENERIC; CDS_LOCATION: R4B13; ASI_MODEL: A36092-043
R4B14 = C_RES: CDS_PHYS_PART_NAME: C_RES_0402-A36092-043,RES,100,1%,0.0625W,TK0,GENERIC; CDS_LMAN_SYM_OUTLINE: -50,50,50,-50; FP_TECH: TK0; IP: GENERIC; ROOM: NONE; OriginalSymbolOrigin: (-25,75); XY: (4650,-5450); VER: 2; ROT: 0; PHYS_PAGE: 165; LOCATION: R4B14; DRAWING: @RVP1_ADL_SB_ADP_S_DDR5_SODIMM_2DPC_LIB.H55_DG2_2DPC(SCH_1):PAGE534; CDS_LIB: c_discrete; VARIANT: ?; PCB Footprint: CTK0_SM0402_1050X550_MA; CHIPS_PART_NAME: C_RES; CDS_PART_NAME: C_RES_0402-A36092-043,RES,100,1%,0.0625W,TK0,GENERIC; CDS_LOCATION: R4B14; ASI_MODEL: A36092-043
R4B17 = C_RES#1: PART_NUMBER: G60609-001; CHIPS_PART_NAME: C_RES; CDS_PHYS_PART_NAME: C_RES_0402-G60609-001,RES,0,1%,0.0625W,TK2,GENERIC; CDS_LMAN_SYM_OUTLINE: -50,50,50,-50; FP_TECH: TK2; IP: GENERIC; ROOM: NONE; WATTAGE: 0.0625W; OriginalSymbolOrigin: (-75,25); XY: (5550,-5600); VER: 1; PHYS_PAGE: 165; LOCATION: R4B17; DRAWING: @RVP1_ADL_SB_ADP_S_DDR5_SODIMM_2DPC_LIB.H55_DG2_2DPC(SCH_1):PAGE534; CDS_LIB: c_discrete; VARIANT: ?; PCB Footprint: CTK2_SM0402_1050X550_MA; ROT: 0; CDS_PART_NAME: C_RES_0402-G60609-001,RES,0,1%,0.0625W,TK2,GENERIC; CDS_LOCATION: R4B17; ASI_MODEL: G60609-001
R4B22 = C_RES#1: PART_NUMBER: G60609-001; CHIPS_PART_NAME: C_RES; CDS_PHYS_PART_NAME: C_RES_0402-G60609-001,RES,0,1%,0.0625W,TK2,GENERIC; CDS_LMAN_SYM_OUTLINE: -50,50,50,-50; FP_TECH: TK2; IP: GENERIC; ROOM: NONE; WATTAGE: 0.0625W; OriginalSymbolOrigin: (-75,25); XY: (5550,-5900); VER: 1; PHYS_PAGE: 165; LOCATION: R4B22; DRAWING: @RVP1_ADL_SB_ADP_S_DDR5_SODIMM_2DPC_LIB.H55_DG2_2DPC(SCH_1):PAGE534; CDS_LIB: c_discrete; VARIANT: ?; PCB Footprint: CTK2_SM0402_1050X550_MA; ROT: 0; CDS_PART_NAME: C_RES_0402-G60609-001,RES,0,1%,0.0625W,TK2,GENERIC; CDS_LOCATION: R4B22; ASI_MODEL: G60609-001
R4B31 = RES_2: CDS_PHYS_PART_NAME: RES_2_0402-A93548-167,RES,61.9K,1%,0.063W,TK0,GENERIC; CDS_LMAN_SYM_OUTLINE: -50,50,50,-50; FP_TECH: TK0; IP: GENERIC; ROOM: NONE; OriginalSymbolOrigin: (-25,75); XY: (725,-4700); VER: 2; ROT: 0; PHYS_PAGE: 165; LOCATION: R4B31; DRAWING: @RVP1_ADL_SB_ADP_S_DDR5_SODIMM_2DPC_LIB.H55_DG2_2DPC(SCH_1):PAGE534; CDS_LIB: discrete_2; VARIANT: ?; PCB Footprint: TK0_SM0402_1100X550_MI; CHIPS_PART_NAME: RES_2; CDS_PART_NAME: RES_2_0402-A93548-167,RES,61.9K,1%,0.063W,TK0,GENERIC; CDS_LOCATION: R4B31; ASI_MODEL: A93548-167
R4B33 = C_RES#1: CHIPS_PART_NAME: C_RES; CDS_PHYS_PART_NAME: RES_402-75,5%,402"; CDS_PART_NAME: C_RES_0402-A93549-008,EMPTY,75,5%,0.0625W,TK2,GENERIC; CDS_LMAN_SYM_OUTLINE: -50,50,50,-50; FP_TECH: TK2; IP: GENERIC; ROOM: NONE; OriginalSymbolOrigin: (-75,25); XY: (6275,-4575); VER: 1; ROT: 0; PHYS_PAGE: 165; LOCATION: R4B33; DRAWING: @RVP1_ADL_SB_ADP_S_DDR5_SODIMM_2DPC_LIB.H55_DG2_2DPC(SCH_1):PAGE534; CDS_LIB: c_discrete; VARIANT: ?; PCB Footprint: CTK2_SM0402_1050X550_MA; CDS_LOCATION: R4B33; ASI_MODEL: A93549-008
R4B34 = C_RES: CDS_PHYS_PART_NAME: C_RES_0402-A93549-023,RES,10K,5%,0.0625W,TK0,GENERIC; CDS_LMAN_SYM_OUTLINE: -50,50,50,-50; FP_TECH: TK0; IP: GENERIC; ROOM: NONE; OriginalSymbolOrigin: (-25,75); XY: (3550,-6800); VER: 2; PHYS_PAGE: 165; LOCATION: R4B34; DRAWING: @RVP1_ADL_SB_ADP_S_DDR5_SODIMM_2DPC_LIB.H55_DG2_2DPC(SCH_1):PAGE534; CDS_LIB: c_discrete; VARIANT: ?; PCB Footprint: CTK0_SM0402_1100X550_MA; ROT: 2; CHIPS_PART_NAME: C_RES; CDS_PART_NAME: C_RES_0402-A93549-023,RES,10K,5%,0.0625W,TK0,GENERIC; CDS_LOCATION: R4B34; ASI_MODEL: A93549-023
R4B35 = RES: CDS_PHYS_PART_NAME: RES_0402-G21796-016,EMPTY,10K,1%,1/16W,LPDB,GENERIC; OriginalSymbolOrigin: (-25,75); XY: (1875,-5725); VER: 2; ROT: 0; PHYS_PAGE: 165; LOCATION: R4B35; IP: GENERIC; FP_TECH: LPDB; DRAWING: @RVP1_ADL_SB_ADP_S_DDR5_SODIMM_2DPC_LIB.H55_DG2_2DPC(SCH_1):PAGE534; CDS_LIB: discrete; PCB Footprint: SMR0402IA; CHIPS_PART_NAME: RES; CDS_PART_NAME: RES_0402-G21796-016,EMPTY,10K,1%,1/16W,LPDB,GENERIC; CDS_LOCATION: R4B35
R4M20 = C_RES: CDS_PHYS_PART_NAME: C_RES_0402-A93549-027,EMPTY,100K,5%,0.0625W,TK0,GENERIC; CDS_LMAN_SYM_OUTLINE: -50,50,50,-50; FP_TECH: TK0; IP: GENERIC; ROOM: NONE; OriginalSymbolOrigin: (-25,75); XY: (1500,-5750); VER: 2; ROT: 0; PHYS_PAGE: 165; LOCATION: R4M20; DRAWING: @RVP1_ADL_SB_ADP_S_DDR5_SODIMM_2DPC_LIB.H55_DG2_2DPC(SCH_1):PAGE534; CDS_LIB: c_discrete; VARIANT: ?; PCB Footprint: CTK0_SM0402_1100X550_MA; CHIPS_PART_NAME: C_RES; CDS_PART_NAME: C_RES_0402-A93549-027,EMPTY,100K,5%,0.0625W,TK0,GENERIC; CDS_LOCATION: R4M20; ASI_MODEL: A93549-027
R4M22 = C_RES: CDS_PHYS_PART_NAME: C_RES_0402-A93549-027,EMPTY,100K,5%,0.0625W,TK0,GENERIC; CDS_LMAN_SYM_OUTLINE: -50,50,50,-50; FP_TECH: TK0; IP: GENERIC; ROOM: NONE; OriginalSymbolOrigin: (-25,75); XY: (1525,-6525); VER: 2; ROT: 0; PHYS_PAGE: 165; LOCATION: R4M22; DRAWING: @RVP1_ADL_SB_ADP_S_DDR5_SODIMM_2DPC_LIB.H55_DG2_2DPC(SCH_1):PAGE534; CDS_LIB: c_discrete; VARIANT: ?; PCB Footprint: CTK0_SM0402_1100X550_MA; CHIPS_PART_NAME: C_RES; CDS_PART_NAME: C_RES_0402-A93549-027,EMPTY,100K,5%,0.0625W,TK0,GENERIC; CDS_LOCATION: R4M22; ASI_MODEL: A93549-027
R4M28 = C_RES: CDS_PHYS_PART_NAME: C_RES_0402-A93549-027,EMPTY,100K,5%,0.0625W,TK0,GENERIC; CDS_LMAN_SYM_OUTLINE: -50,50,50,-50; FP_TECH: TK0; IP: GENERIC; ROOM: NONE; OriginalSymbolOrigin: (-25,75); XY: (1150,-5725); VER: 2; ROT: 0; PHYS_PAGE: 165; LOCATION: R4M28; DRAWING: @RVP1_ADL_SB_ADP_S_DDR5_SODIMM_2DPC_LIB.H55_DG2_2DPC(SCH_1):PAGE534; CDS_LIB: c_discrete; VARIANT: ?; PCB Footprint: CTK0_SM0402_1100X550_MA; CHIPS_PART_NAME: C_RES; CDS_PART_NAME: C_RES_0402-A93549-027,EMPTY,100K,5%,0.0625W,TK0,GENERIC; CDS_LOCATION: R4M28; ASI_MODEL: A93549-027
R4M33 = C_RES: CDS_PHYS_PART_NAME: C_RES_0402-A93549-027,RES,100K,5%,0.0625W,TK0,GENERIC; CDS_LMAN_SYM_OUTLINE: -50,50,50,-50; FP_TECH: TK0; IP: GENERIC; ROOM: NONE; OriginalSymbolOrigin: (-25,75); XY: (1200,-6550); VER: 2; ROT: 0; PHYS_PAGE: 165; LOCATION: R4M33; DRAWING: @RVP1_ADL_SB_ADP_S_DDR5_SODIMM_2DPC_LIB.H55_DG2_2DPC(SCH_1):PAGE534; CDS_LIB: c_discrete; VARIANT: ?; PCB Footprint: CTK0_SM0402_1100X550_MA; CHIPS_PART_NAME: C_RES; CDS_PART_NAME: C_RES_0402-A93549-027,RES,100K,5%,0.0625W,TK0,GENERIC; CDS_LOCATION: R4M33; ASI_MODEL: A93549-027
R16601 = C_RES#1: PART_NUMBER: A93549-001; CHIPS_PART_NAME: C_RES; CDS_PHYS_PART_NAME: C_RES_0402-A93549-001,RES,0,5%,0.0625W,TK0,GENERIC; CDS_LMAN_SYM_OUTLINE: -50,50,50,-50; FP_TECH: TK0; IP: GENERIC; ROOM: NONE; WATTAGE: 0.0625W; OriginalSymbolOrigin: (-75,25); XY: (650,-6100); VER: 1; PHYS_PAGE: 165; LOCATION: R16601; DRAWING: @RVP1_ADL_SB_ADP_S_DDR5_SODIMM_2DPC_LIB.H55_DG2_2DPC(SCH_1):PAGE534; CDS_LIB: c_discrete; VARIANT: ?; PCB Footprint: CTK0_SM0402_1100X550_MA; ROT: 0; CDS_PART_NAME: C_RES_0402-A93549-001,RES,0,5%,0.0625W,TK0,GENERIC; CDS_LOCATION: R16601; ASI_MODEL: A93549-001
R16602 = C_RES#1: PART_NUMBER: A93549-001; CHIPS_PART_NAME: C_RES; CDS_PHYS_PART_NAME: C_RES_0402-A93549-001,RES,0,5%,0.0625W,TK0,GENERIC; CDS_LMAN_SYM_OUTLINE: -50,50,50,-50; FP_TECH: TK0; IP: GENERIC; ROOM: NONE; WATTAGE: 0.0625W; OriginalSymbolOrigin: (-75,25); XY: (650,-6250); VER: 1; PHYS_PAGE: 165; LOCATION: R16602; DRAWING: @RVP1_ADL_SB_ADP_S_DDR5_SODIMM_2DPC_LIB.H55_DG2_2DPC(SCH_1):PAGE534; CDS_LIB: c_discrete; VARIANT: ?; PCB Footprint: CTK0_SM0402_1100X550_MA; ROT: 0; CDS_PART_NAME: C_RES_0402-A93549-001,RES,0,5%,0.0625W,TK0,GENERIC; CDS_LOCATION: R16602; ASI_MODEL: A93549-001
R16603 = C_RES#1: PART_NUMBER: A93549-001; CHIPS_PART_NAME: C_RES; CDS_PHYS_PART_NAME: C_RES_0402-A93549-001,EMPTY,0,5%,0.0625W,TK0,GENERIC; CDS_LMAN_SYM_OUTLINE: -50,50,50,-50; FP_TECH: TK0; IP: GENERIC; ROOM: NONE; WATTAGE: 0.0625W; OriginalSymbolOrigin: (-75,25); XY: (650,-6450); VER: 1; PHYS_PAGE: 165; LOCATION: R16603; DRAWING: @RVP1_ADL_SB_ADP_S_DDR5_SODIMM_2DPC_LIB.H55_DG2_2DPC(SCH_1):PAGE534; CDS_LIB: c_discrete; VARIANT: ?; PCB Footprint: CTK0_SM0402_1100X550_MA; ROT: 0; CDS_PART_NAME: C_RES_0402-A93549-001,EMPTY,0,5%,0.0625W,TK0,GENERIC; CDS_LOCATION: R16603; ASI_MODEL: A93549-001
R16604 = C_RES#1: PART_NUMBER: A93549-001; CHIPS_PART_NAME: C_RES; CDS_PHYS_PART_NAME: C_RES_0402-A93549-001,EMPTY,0,5%,0.0625W,TK0,GENERIC; CDS_LMAN_SYM_OUTLINE: -50,50,50,-50; FP_TECH: TK0; IP: GENERIC; ROOM: NONE; WATTAGE: 0.0625W; OriginalSymbolOrigin: (-75,25); XY: (1925,-3825); VER: 1; PHYS_PAGE: 165; LOCATION: R16604; DRAWING: @RVP1_ADL_SB_ADP_S_DDR5_SODIMM_2DPC_LIB.H55_DG2_2DPC(SCH_1):PAGE534; CDS_LIB: c_discrete; VARIANT: ?; PCB Footprint: CTK0_SM0402_1100X550_MA; ROT: 0; CDS_PART_NAME: C_RES_0402-A93549-001,EMPTY,0,5%,0.0625W,TK0,GENERIC; CDS_LOCATION: R16604; ASI_MODEL: A93549-001
R16605 = C_RES#1: PART_NUMBER: A93549-001; CHIPS_PART_NAME: C_RES; CDS_PHYS_PART_NAME: C_RES_0402-A93549-001,RES,0,5%,0.0625W,TK0,GENERIC; CDS_LMAN_SYM_OUTLINE: -50,50,50,-50; FP_TECH: TK0; IP: GENERIC; ROOM: NONE; WATTAGE: 0.0625W; OriginalSymbolOrigin: (-75,25); XY: (1925,-3925); VER: 1; PHYS_PAGE: 165; LOCATION: R16605; DRAWING: @RVP1_ADL_SB_ADP_S_DDR5_SODIMM_2DPC_LIB.H55_DG2_2DPC(SCH_1):PAGE534; CDS_LIB: c_discrete; VARIANT: ?; PCB Footprint: CTK0_SM0402_1100X550_MA; ROT: 0; CDS_PART_NAME: C_RES_0402-A93549-001,RES,0,5%,0.0625W,TK0,GENERIC; CDS_LOCATION: R16605; ASI_MODEL: A93549-001
R16606 = C_RES#1: PART_NUMBER: A93549-001; CHIPS_PART_NAME: C_RES; CDS_PHYS_PART_NAME: C_RES_0402-A93549-001,RES,0,5%,0.0625W,TK0,GENERIC; CDS_LMAN_SYM_OUTLINE: -50,50,50,-50; FP_TECH: TK0; IP: GENERIC; ROOM: NONE; WATTAGE: 0.0625W; OriginalSymbolOrigin: (-75,25); XY: (1925,-3975); VER: 1; PHYS_PAGE: 165; LOCATION: R16606; DRAWING: @RVP1_ADL_SB_ADP_S_DDR5_SODIMM_2DPC_LIB.H55_DG2_2DPC(SCH_1):PAGE534; CDS_LIB: c_discrete; VARIANT: ?; PCB Footprint: CTK0_SM0402_1100X550_MA; ROT: 0; CDS_PART_NAME: C_RES_0402-A93549-001,RES,0,5%,0.0625W,TK0,GENERIC; CDS_LOCATION: R16606; ASI_MODEL: A93549-001
R16607 = C_RES#1: PART_NUMBER: A93549-001; CHIPS_PART_NAME: C_RES; CDS_PHYS_PART_NAME: C_RES_0402-A93549-001,EMPTY,0,5%,0.0625W,TK0,GENERIC; CDS_LMAN_SYM_OUTLINE: -50,50,50,-50; FP_TECH: TK0; IP: GENERIC; ROOM: NONE; WATTAGE: 0.0625W; OriginalSymbolOrigin: (-75,25); XY: (1900,-4075); VER: 1; PHYS_PAGE: 165; LOCATION: R16607; DRAWING: @RVP1_ADL_SB_ADP_S_DDR5_SODIMM_2DPC_LIB.H55_DG2_2DPC(SCH_1):PAGE534; CDS_LIB: c_discrete; VARIANT: ?; PCB Footprint: CTK0_SM0402_1100X550_MA; ROT: 0; CDS_PART_NAME: C_RES_0402-A93549-001,EMPTY,0,5%,0.0625W,TK0,GENERIC; CDS_LOCATION: R16607; ASI_MODEL: A93549-001
R16608 = C_RES#1: PART_NUMBER: A93549-001; CHIPS_PART_NAME: C_RES; CDS_PHYS_PART_NAME: C_RES_0402-A93549-001,EMPTY,0,5%,0.0625W,TK0,GENERIC; CDS_LMAN_SYM_OUTLINE: -50,50,50,-50; FP_TECH: TK0; IP: GENERIC; ROOM: NONE; WATTAGE: 0.0625W; OriginalSymbolOrigin: (-75,25); XY: (2625,-4625); VER: 1; PHYS_PAGE: 165; LOCATION: R16608; DRAWING: @RVP1_ADL_SB_ADP_S_DDR5_SODIMM_2DPC_LIB.H55_DG2_2DPC(SCH_1):PAGE534; CDS_LIB: c_discrete; VARIANT: ?; PCB Footprint: CTK0_SM0402_1100X550_MA; ROT: 0; CDS_PART_NAME: C_RES_0402-A93549-001,EMPTY,0,5%,0.0625W,TK0,GENERIC; CDS_LOCATION: R16608; ASI_MODEL: A93549-001
R16609 = C_RES#1: PART_NUMBER: A93549-001; CHIPS_PART_NAME: C_RES; CDS_PHYS_PART_NAME: C_RES_0402-A93549-001,RES,0,5%,0.0625W,TK0,GENERIC; CDS_LMAN_SYM_OUTLINE: -50,50,50,-50; FP_TECH: TK0; IP: GENERIC; ROOM: NONE; WATTAGE: 0.0625W; OriginalSymbolOrigin: (-75,25); XY: (3300,-4275); VER: 1; PHYS_PAGE: 165; LOCATION: R16609; DRAWING: @RVP1_ADL_SB_ADP_S_DDR5_SODIMM_2DPC_LIB.H55_DG2_2DPC(SCH_1):PAGE534; CDS_LIB: c_discrete; VARIANT: ?; PCB Footprint: CTK0_SM0402_1100X550_MA; ROT: 0; CDS_PART_NAME: C_RES_0402-A93549-001,RES,0,5%,0.0625W,TK0,GENERIC; CDS_LOCATION: R16609; ASI_MODEL: A93549-001
R16610 = C_RES#1: PART_NUMBER: A93549-001; CHIPS_PART_NAME: C_RES; CDS_PHYS_PART_NAME: C_RES_0402-A93549-001,RES,0,5%,0.0625W,TK0,GENERIC; CDS_LMAN_SYM_OUTLINE: -50,50,50,-50; FP_TECH: TK0; IP: GENERIC; ROOM: NONE; WATTAGE: 0.0625W; OriginalSymbolOrigin: (-75,25); XY: (3300,-5000); VER: 1; PHYS_PAGE: 165; LOCATION: R16610; DRAWING: @RVP1_ADL_SB_ADP_S_DDR5_SODIMM_2DPC_LIB.H55_DG2_2DPC(SCH_1):PAGE534; CDS_LIB: c_discrete; VARIANT: ?; PCB Footprint: CTK0_SM0402_1100X550_MA; ROT: 0; CDS_PART_NAME: C_RES_0402-A93549-001,RES,0,5%,0.0625W,TK0,GENERIC; CDS_LOCATION: R16610; ASI_MODEL: A93549-001